# EAGLE design LED_BRD (EAGLE 6.5.0)
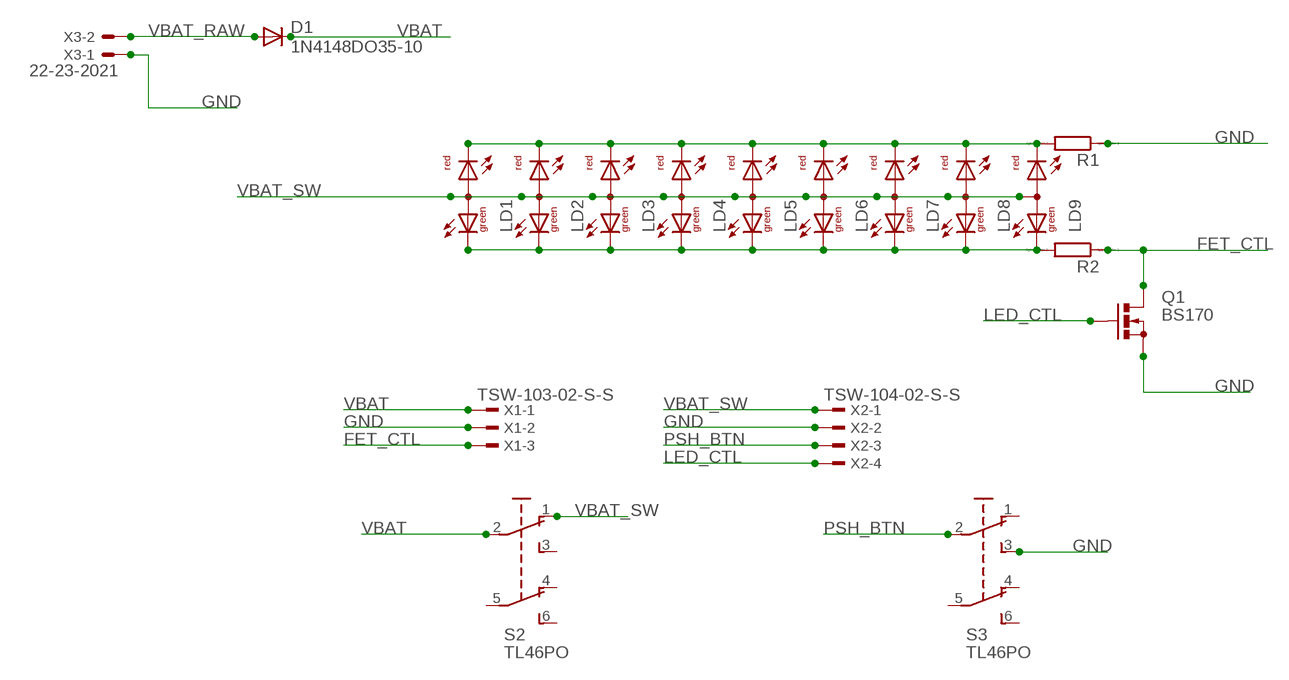
[diagram p0: schematic, sheet 1]

## Parts
D1  1N4148DO35-10  [DO35-10]
LD1  DUOLED-RG-A  [DUOLED-A-5MM]
LD2  DUOLED-RG-A  [DUOLED-A-5MM]
LD3  DUOLED-RG-A  [DUOLED-A-5MM]
LD4  DUOLED-RG-A  [DUOLED-A-5MM]
LD5  DUOLED-RG-A  [DUOLED-A-5MM]
LD6  DUOLED-RG-A  [DUOLED-A-5MM]
LD7  DUOLED-RG-A  [DUOLED-A-5MM]
LD8  DUOLED-RG-A  [DUOLED-A-5MM]
LD9  DUOLED-RG-A  [DUOLED-A-5MM]
Q1  BS170  [SOT54E]
R1  R0204/7  [0204/7]
R2  R0204/7  [0204/7]
S2  TL46PO  [TL4XPO]
S3  TL46PO  [TL4XPO]
X1  TSW-103-02-S-S  [TSW-103-02-S-S]
X2  TSW-104-02-S-S  [TSW-104-02-S-S]
X3  22-23-2021  [22-23-2021]

## Nets
FET_CTL: Q1.D R2.1 X1.3
GND: Q1.S R1.1 S3.3(S) X1.2 X2.2 X3.1
LED_CTL: Q1.G X2.4
N$1: LD1.CX(CG) LD2.CX(CG) LD3.CX(CG) LD4.CX(CG) LD5.CX(CG) LD6.CX(CG) LD7.CX(CG) LD8.CX(CG) LD9.CX(CG) R2.2
N$2: LD1.CR LD2.CR LD3.CR LD4.CR LD5.CR LD6.CR LD7.CR LD8.CR LD9.CR R1.2
PSH_BTN: S3.2(P) X2.3
VBAT: D1.C S2.2(P) X1.1
VBAT_RAW: D1.A X3.2
VBAT_SW: LD1.A LD2.A LD3.A LD4.A LD5.A LD6.A LD7.A LD8.A LD9.A S2.1(O) X2.1
Unconnected: S2.3(S) S2.4(O1) S2.5(P1) S2.6(S1) S3.1(O) S3.4(O1) S3.5(P1) S3.6(S1)

## Library data of the parts
D1 = diode:1N4148: DIODE high speed (Philips)
LD1-LD9 = led:DUOLED-RG-A: DUO LED 2 colors (red/green), 5 mm, round, common Anode www.ligitek.com or other producers.
Q1 = transistor-small-signal:BS170: N-CHANNEL MOS FET
R1 R2 = eagle-ltspice:R: RESISTOR, European symbol; SPICEMODEL: NONE; SPICEPREFIX: R
S2 S3 = switch:TL46PO: TINY SWITCH ON - ON Source: http://www2.produktinfo.conrad.com/datenblaetter/700000-724999/705152-da-01-de-Subminiaturschalter_TL_36YO.pdf
X1 = con-samtec:TSW-103-02-S-S: THROUGH-HOLE .025" SQ POST HEADER Source: Samtec TSW.pdf; OC_FARNELL: unknown; OC_NEWARK: unknown
X2 = con-samtec:TSW-104-02-S-S: THROUGH-HOLE .025" SQ POST HEADER Source: Samtec TSW.pdf; OC_FARNELL: unknown; OC_NEWARK: unknown
X3 = con-molex:22-23-2021: .100" (2.54mm) Center Header - 2 Pin; MF: MOLEX; MPN: 22-23-2021; OC_FARNELL: 1462926; OC_NEWARK: 25C3832

## Board
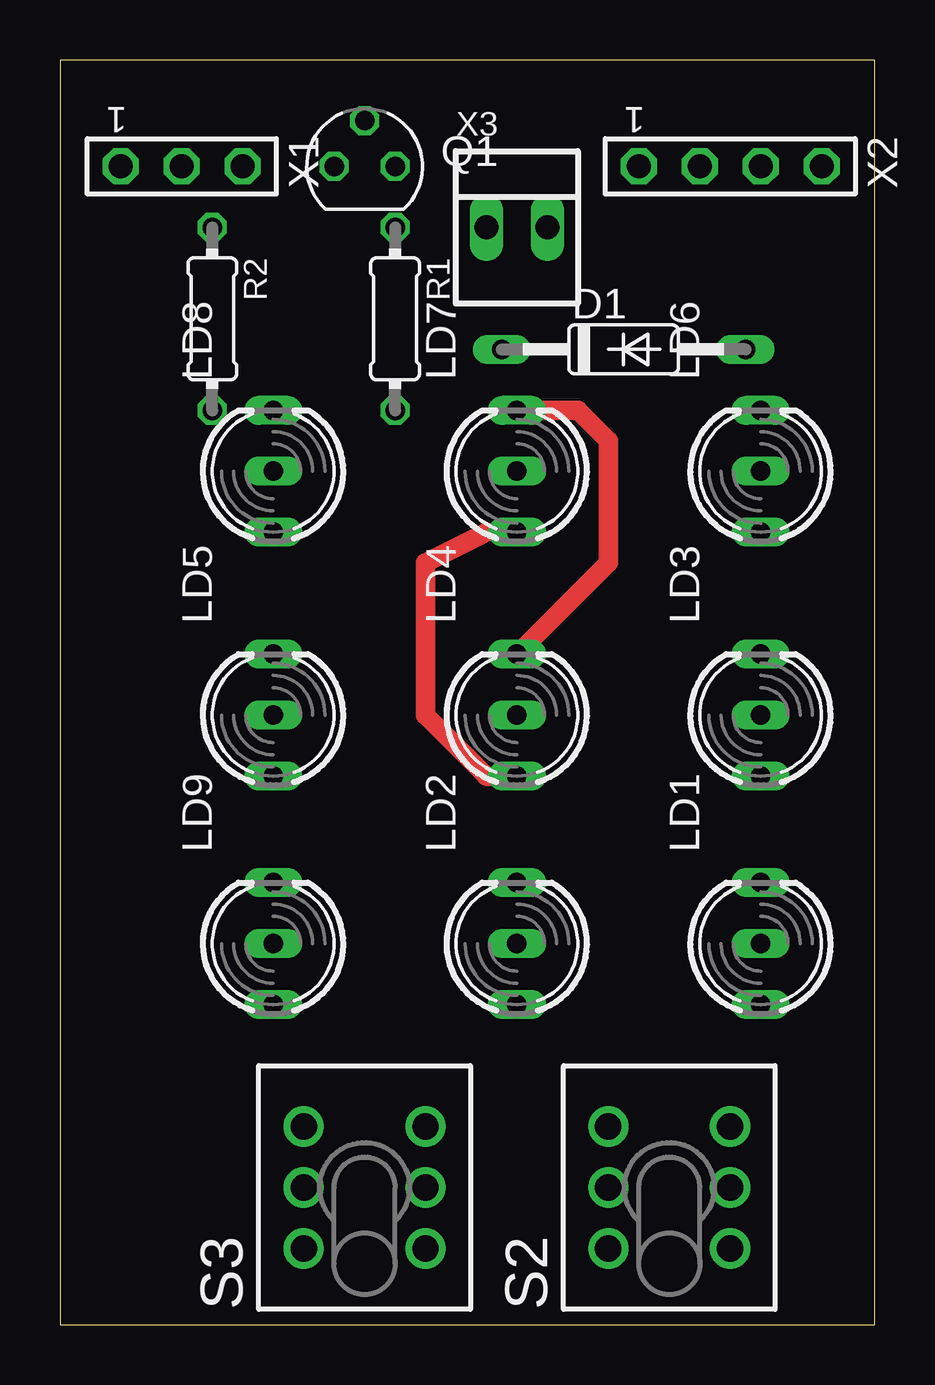
[diagram p1: board, top side]
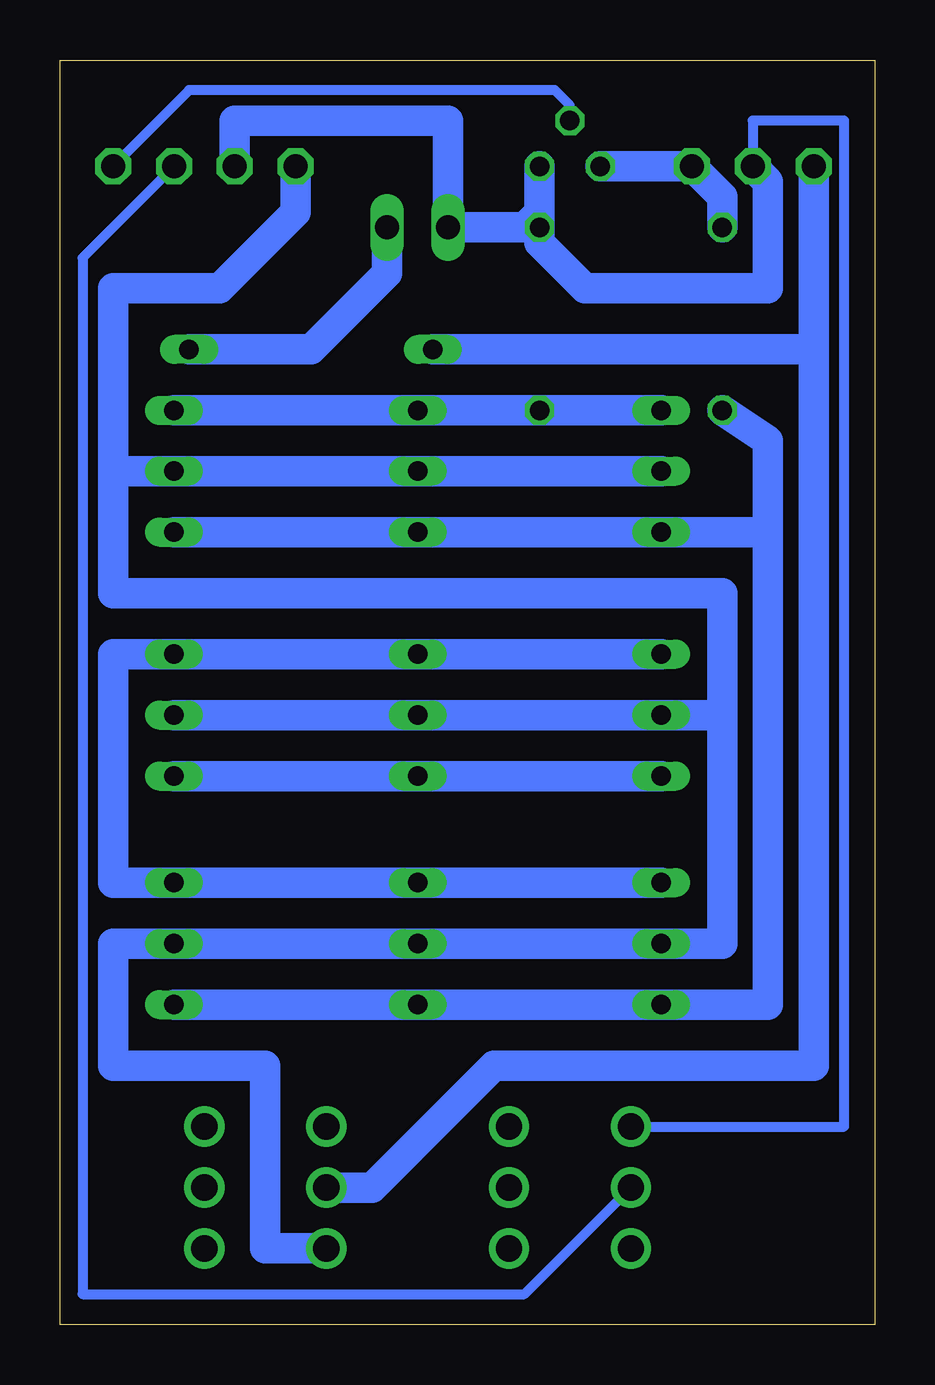
[diagram p2: board, bottom side, seen from below]

Size 33.96 x 52.7 mm. Coordinates in mm from the lower left corner, seen from the top.
Outline: 0,0 33.96,0 33.96,52.7 0,52.7 0,0
Copper layers (1*16): Top 0.018mm / dielectric 1.55mm / Bottom 0.018mm
Design rules "eC-PCB_proto-2-layer": minimum track width 0.15mm, minimum drill 0.25mm, track to track 0.15mm, track to pad 0.15mm, pad to pad 0.15mm, via to via 0.15mm, smd to smd 0.15mm, copper to edge 0.45mm, drill to drill 0.3mm, minimum pad ring 0.2mm, minimum via ring 0.2mm, stop-mask expansion 0.1mm, vias tented up to drill 0mil, thermal gap 0.2mm

### Footprints (pad centres in the part's own frame; a part is rotated, then mirrored left to right if it is on the bottom)
DO35-10 = drill 0.813 long: A 5.08,0; C -5.08,0
DUOLED-A-5MM = drill 0.813 long: A 0,0; CR 2.54,0; CX -2.54,0
SOT54E = drill 0.813 octagon: D -1.27,0; G 0,1.905; S 1.27,0
0204/7 = drill 0.813 octagon: 1 -3.81,0; 2 3.81,0
TL4XPO = drill 1.1 pad 1.676: 1 -2.54,2.54; 2 0,2.54; 3 2.54,2.54; 4 -2.54,-2.54; 5 0,-2.54; 6 2.54,-2.54
TSW-103-02-S-S = drill 1 pad 1.5 octagon: 1 2.54,0; 2 0,0; 3 -2.54,0
TSW-104-02-S-S = drill 1 pad 1.5 octagon: 1 3.81,0; 2 1.27,0; 3 -1.27,0; 4 -3.81,0
22-23-2021 = drill 1 long: 1 -1.27,0; 2 1.27,0

### Placement (x,y rotation side)
D1  23.5,40.64 0 top
LD1  29.21,15.88 90 top
LD2  19.05,15.88 90 top
LD3  29.21,25.4 90 top
LD4  19.05,25.4 90 top
LD5  8.89,25.4 90 top
LD6  29.21,35.56 90 top
LD7  19.05,35.56 90 top
LD8  8.89,35.56 90 top
LD9  8.89,15.88 90 top
Q1  12.7,48.26 0 top
R1  13.97,41.91 270 top
R2  6.35,41.91 270 top
S2  25.4,5.71 90 top
S3  12.7,5.71 90 top
X1  5.08,48.26 180 top
X2  27.94,48.26 180 top
X3  19.05,45.72 0 top

### Tracks (layer width: path | path; a pad name or v marks a point on that pad's centre or on a via)
FET_CTL
  Bottom 1.27: R2.1 6.35,46.99 X1.3 Q1.D
GND
  Bottom 0.406: S3.3 1.27,8.26 1.27,50.16 5.08,50.16 X1.2
  Bottom 1.27: X1.2 4.45,47.62 4.45,43.18 12.06,43.18 13.97,45.09 R1.1 Q1.S 13.97,46.35 14.61,45.72 X3.1 17.78,50.16 26.67,50.16 X2.2
LED_CTL
  Bottom 0.406: Q1.G 12.7,50.8 13.34,51.44 28.57,51.44 X2.4
N$1
  Top 0.406: LD7.CX 17.78,33.02
  Top 0.813: 17.78,33.02 15.24,31.75 15.24,25.4 17.78,22.86 LD4.CX
  Bottom 1.27: LD1.CX LD2.CX | LD2.CX LD9.CX | LD5.CX LD4.CX LD3.CX | R2.2 4.45,36.83 4.45,33.02 | 4.45,33.02 LD8.CX LD7.CX LD6.CX | LD2.CX 4.45,13.34 4.45,33.02
N$2
  Top 0.813: LD4.CR 22.86,31.75 22.86,36.83 21.59,38.1 LD7.CR
  Bottom 1.27: LD9.CR LD2.CR LD1.CR 31.75,18.41 31.75,27.94 LD3.CR LD4.CR LD5.CR | LD8.CR LD7.CR | LD7.CR LD6.CR | LD7.CR 22.86,38.1 | LD7.CR R1.2
PSH_BTN
  Bottom 0.406: X2.3 33.02,44.45 33.02,1.27 14.61,1.27 S3.2
VBAT
  Bottom 1.27: S2.2 20.95,5.71 15.88,10.79 2.54,10.79 2.54,40.64 | X1.1 2.54,40.64 | 2.54,40.64 D1.C
VBAT_RAW
  Bottom 1.27: X3.2 20.32,43.81 23.5,40.64 D1.A
VBAT_SW
  Bottom 1.27: S2.1 25.4,3.17 25.4,10.79 31.75,10.79 31.75,15.88 LD1.A LD2.A LD9.A 6.35,15.88 6.35,25.4 | LD5.A LD4.A LD3.A LD5.A | LD8.A LD7.A LD6.A 31.75,35.56 | LD5.A 6.35,25.4 | 6.35,25.4 6.35,30.48 31.75,30.48 31.75,35.56 | 31.75,35.56 31.75,43.18 27.3,43.18 24.13,46.35 X2.1